# Altium schematic sheet Ethernet.SchDoc
size A4; SheetNumber: 3; SheetTotal: 5
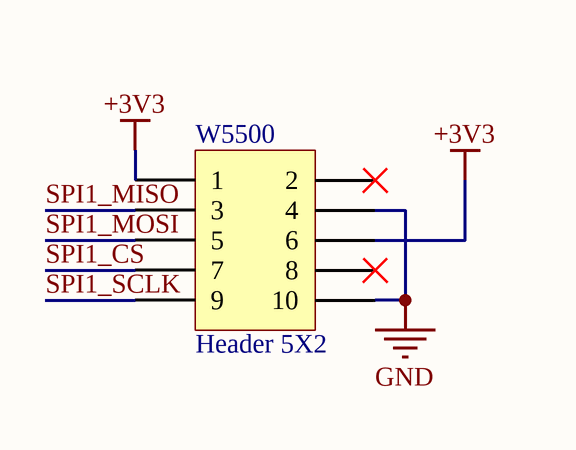
[diagram p0: Ethernet.SchDoc]

## Parts
W5500  Header 5X2  [HDR2X5]

## Nets
+3V3: W5500.1 W5500.6
GND: W5500.4 W5500.10
SPI1_CS: W5500.7
SPI1_MISO: W5500.3
SPI1_MOSI: W5500.5
SPI1_SCLK: W5500.9

Not connected (* = marked no-connect by the designer): W5500 2* 8*

## Library data of the parts
W5500 = Header 5X2: Header, 5-Pin, Dual row; LatestRevisionDate: 17-Jul-2002; LatestRevisionNote: Re-released for DXP Platform.; Publisher: Altium Limited